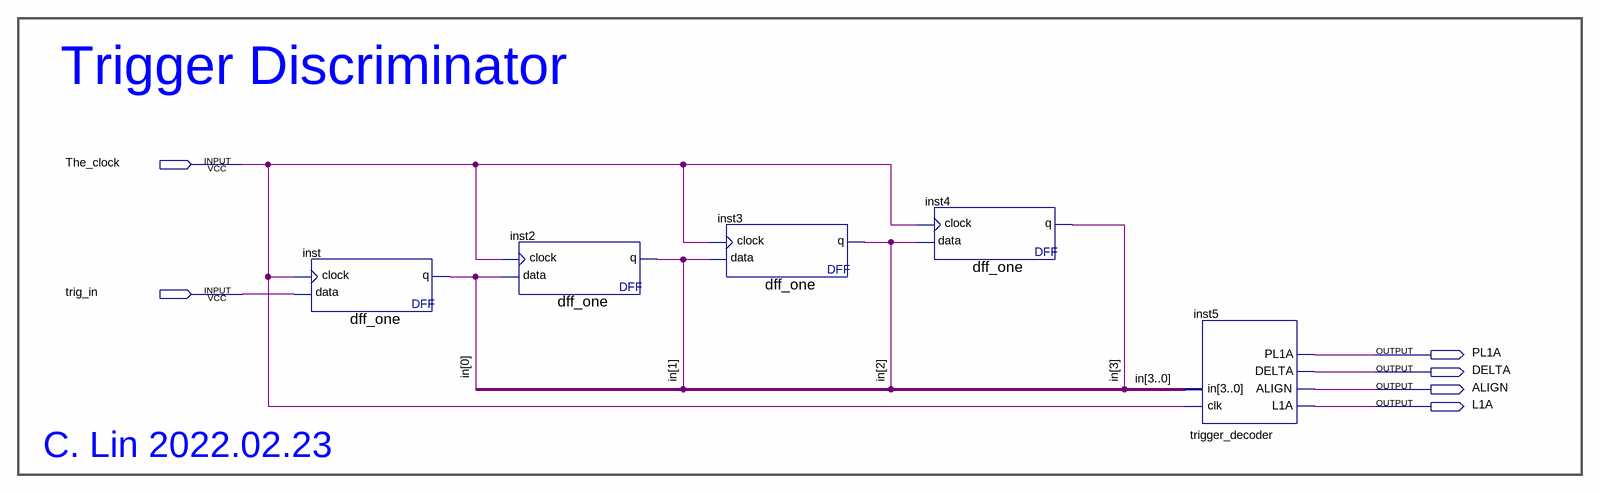
[diagram p0: schematic sheet]
// Quartus schematic trigger_discriminator.bdf as structural Verilog: 5 symbols, 6 pins
module trigger_discriminator (
  input  The_clock,
  input  trig_in,
  output PL1A,
  output DELTA,
  output ALIGN,
  output L1A
);

  wire [3:0] in;

  dff_one inst (.data(trig_in), .clock(The_clock), .q(in[0]));
  dff_one inst2 (.data(in[0]), .clock(The_clock), .q(in[1]));
  dff_one inst3 (.data(in[1]), .clock(The_clock), .q(in[2]));
  dff_one inst4 (.data(in[2]), .clock(The_clock), .q(in[3]));
  trigger_decoder inst5 (.clk(The_clock), .in(in), .L1A(L1A), .ALIGN(ALIGN), .DELTA(DELTA), .PL1A(PL1A));

  // Notes on the sheet:
  //   Trigger Discriminator
  //   C. Lin 2022.02.23
endmodule
